# EAGLE schematic cpu (EAGLE 7.2.0)
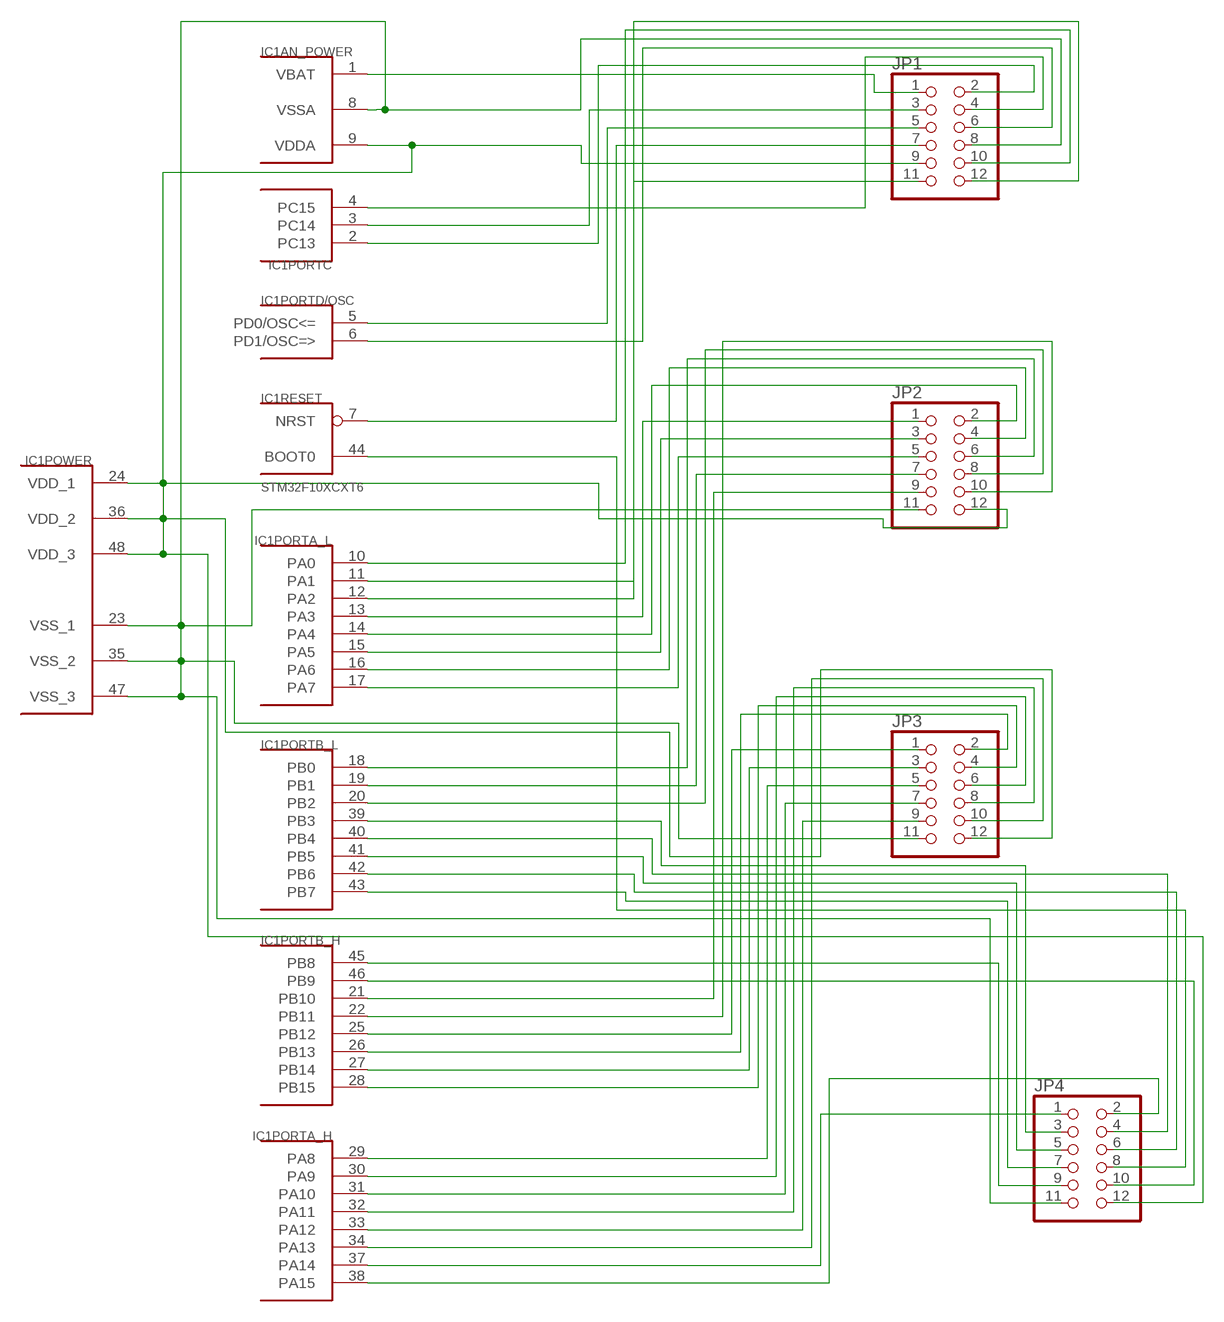
[diagram p0: schematic, sheet 1]

## Parts
IC1  STM32F10XCXT6  [TQFP48]
JP1  PINHD-2X6  [2X06]
JP2  PINHD-2X6  [2X06]
JP3  PINHD-2X6  [2X06]
JP4  PINHD-2X6  [2X06]

## Nets
N$1: IC1.1(AN_POWER:VBAT) JP1.1
N$2: IC1.2(PORTC:PC13) JP1.2
N$3: IC1.3(PORTC:PC14) JP1.3
N$4: IC1.4(PORTC:PC15) JP1.4
N$5: IC1.5(PORTD/OSC:PD0/OSC<=) JP1.5
N$6: IC1.6(PORTD/OSC:PD1/OSC=>) JP1.6
N$7: IC1.7(RESET:NRST) JP1.7
N$10: IC1.10(PORTA_L:PA0) JP1.10
N$11: IC1.11(PORTA_L:PA1) JP1.11
N$12: IC1.12(PORTA_L:PA2) JP1.12
N$13: IC1.13(PORTA_L:PA3) JP2.1
N$14: IC1.14(PORTA_L:PA4) JP2.2
N$15: IC1.15(PORTA_L:PA5) JP2.3
N$16: IC1.16(PORTA_L:PA6) JP2.4
N$17: IC1.17(PORTA_L:PA7) JP2.5
N$18: IC1.18(PORTB_L:PB0) JP2.6
N$19: IC1.19(PORTB_L:PB1) JP2.7
N$20: IC1.20(PORTB_L:PB2) JP2.8
N$21: IC1.21(PORTB_H:PB10) JP2.9
N$22: IC1.22(PORTB_H:PB11) JP2.10
N$24: IC1.9(AN_POWER:VDDA) IC1.24(POWER:VDD_1) IC1.36(POWER:VDD_2) IC1.48(POWER:VDD_3) JP1.9 JP2.12 JP3.12 JP4.12
N$25: IC1.25(PORTB_H:PB12) JP3.1
N$26: IC1.26(PORTB_H:PB13) JP3.2
N$27: IC1.27(PORTB_H:PB14) JP3.3
N$28: IC1.28(PORTB_H:PB15) JP3.4
N$29: IC1.29(PORTA_H:PA8) JP3.5
N$30: IC1.30(PORTA_H:PA9) JP3.6
N$31: IC1.31(PORTA_H:PA10) JP3.7
N$32: IC1.32(PORTA_H:PA11) JP3.8
N$33: IC1.33(PORTA_H:PA12) JP3.9
N$34: IC1.34(PORTA_H:PA13) JP3.10
N$37: IC1.37(PORTA_H:PA14) JP4.1
N$38: IC1.38(PORTA_H:PA15) JP4.2
N$39: IC1.39(PORTB_L:PB3) JP4.3
N$40: IC1.40(PORTB_L:PB4) JP4.4
N$41: IC1.41(PORTB_L:PB5) JP4.5
N$42: IC1.42(PORTB_L:PB6) JP4.6
N$43: IC1.43(PORTB_L:PB7) JP4.7
N$44: IC1.44(RESET:BOOT0) JP4.8
N$45: IC1.45(PORTB_H:PB8) JP4.9
N$46: IC1.46(PORTB_H:PB9) JP4.10
N$47: IC1.8(AN_POWER:VSSA) IC1.23(POWER:VSS_1) IC1.35(POWER:VSS_2) IC1.47(POWER:VSS_3) JP1.8 JP2.11 JP3.11 JP4.11

## Library data of the parts
IC1 = stm32:STM32F10XCXT6: ST STM32F101/103 48pin LQFP
JP1-JP4 = pinhead:PINHD-2X6: PIN HEADER